# Altium project LightLink_V4.PrjPcb (part 1 of 2)
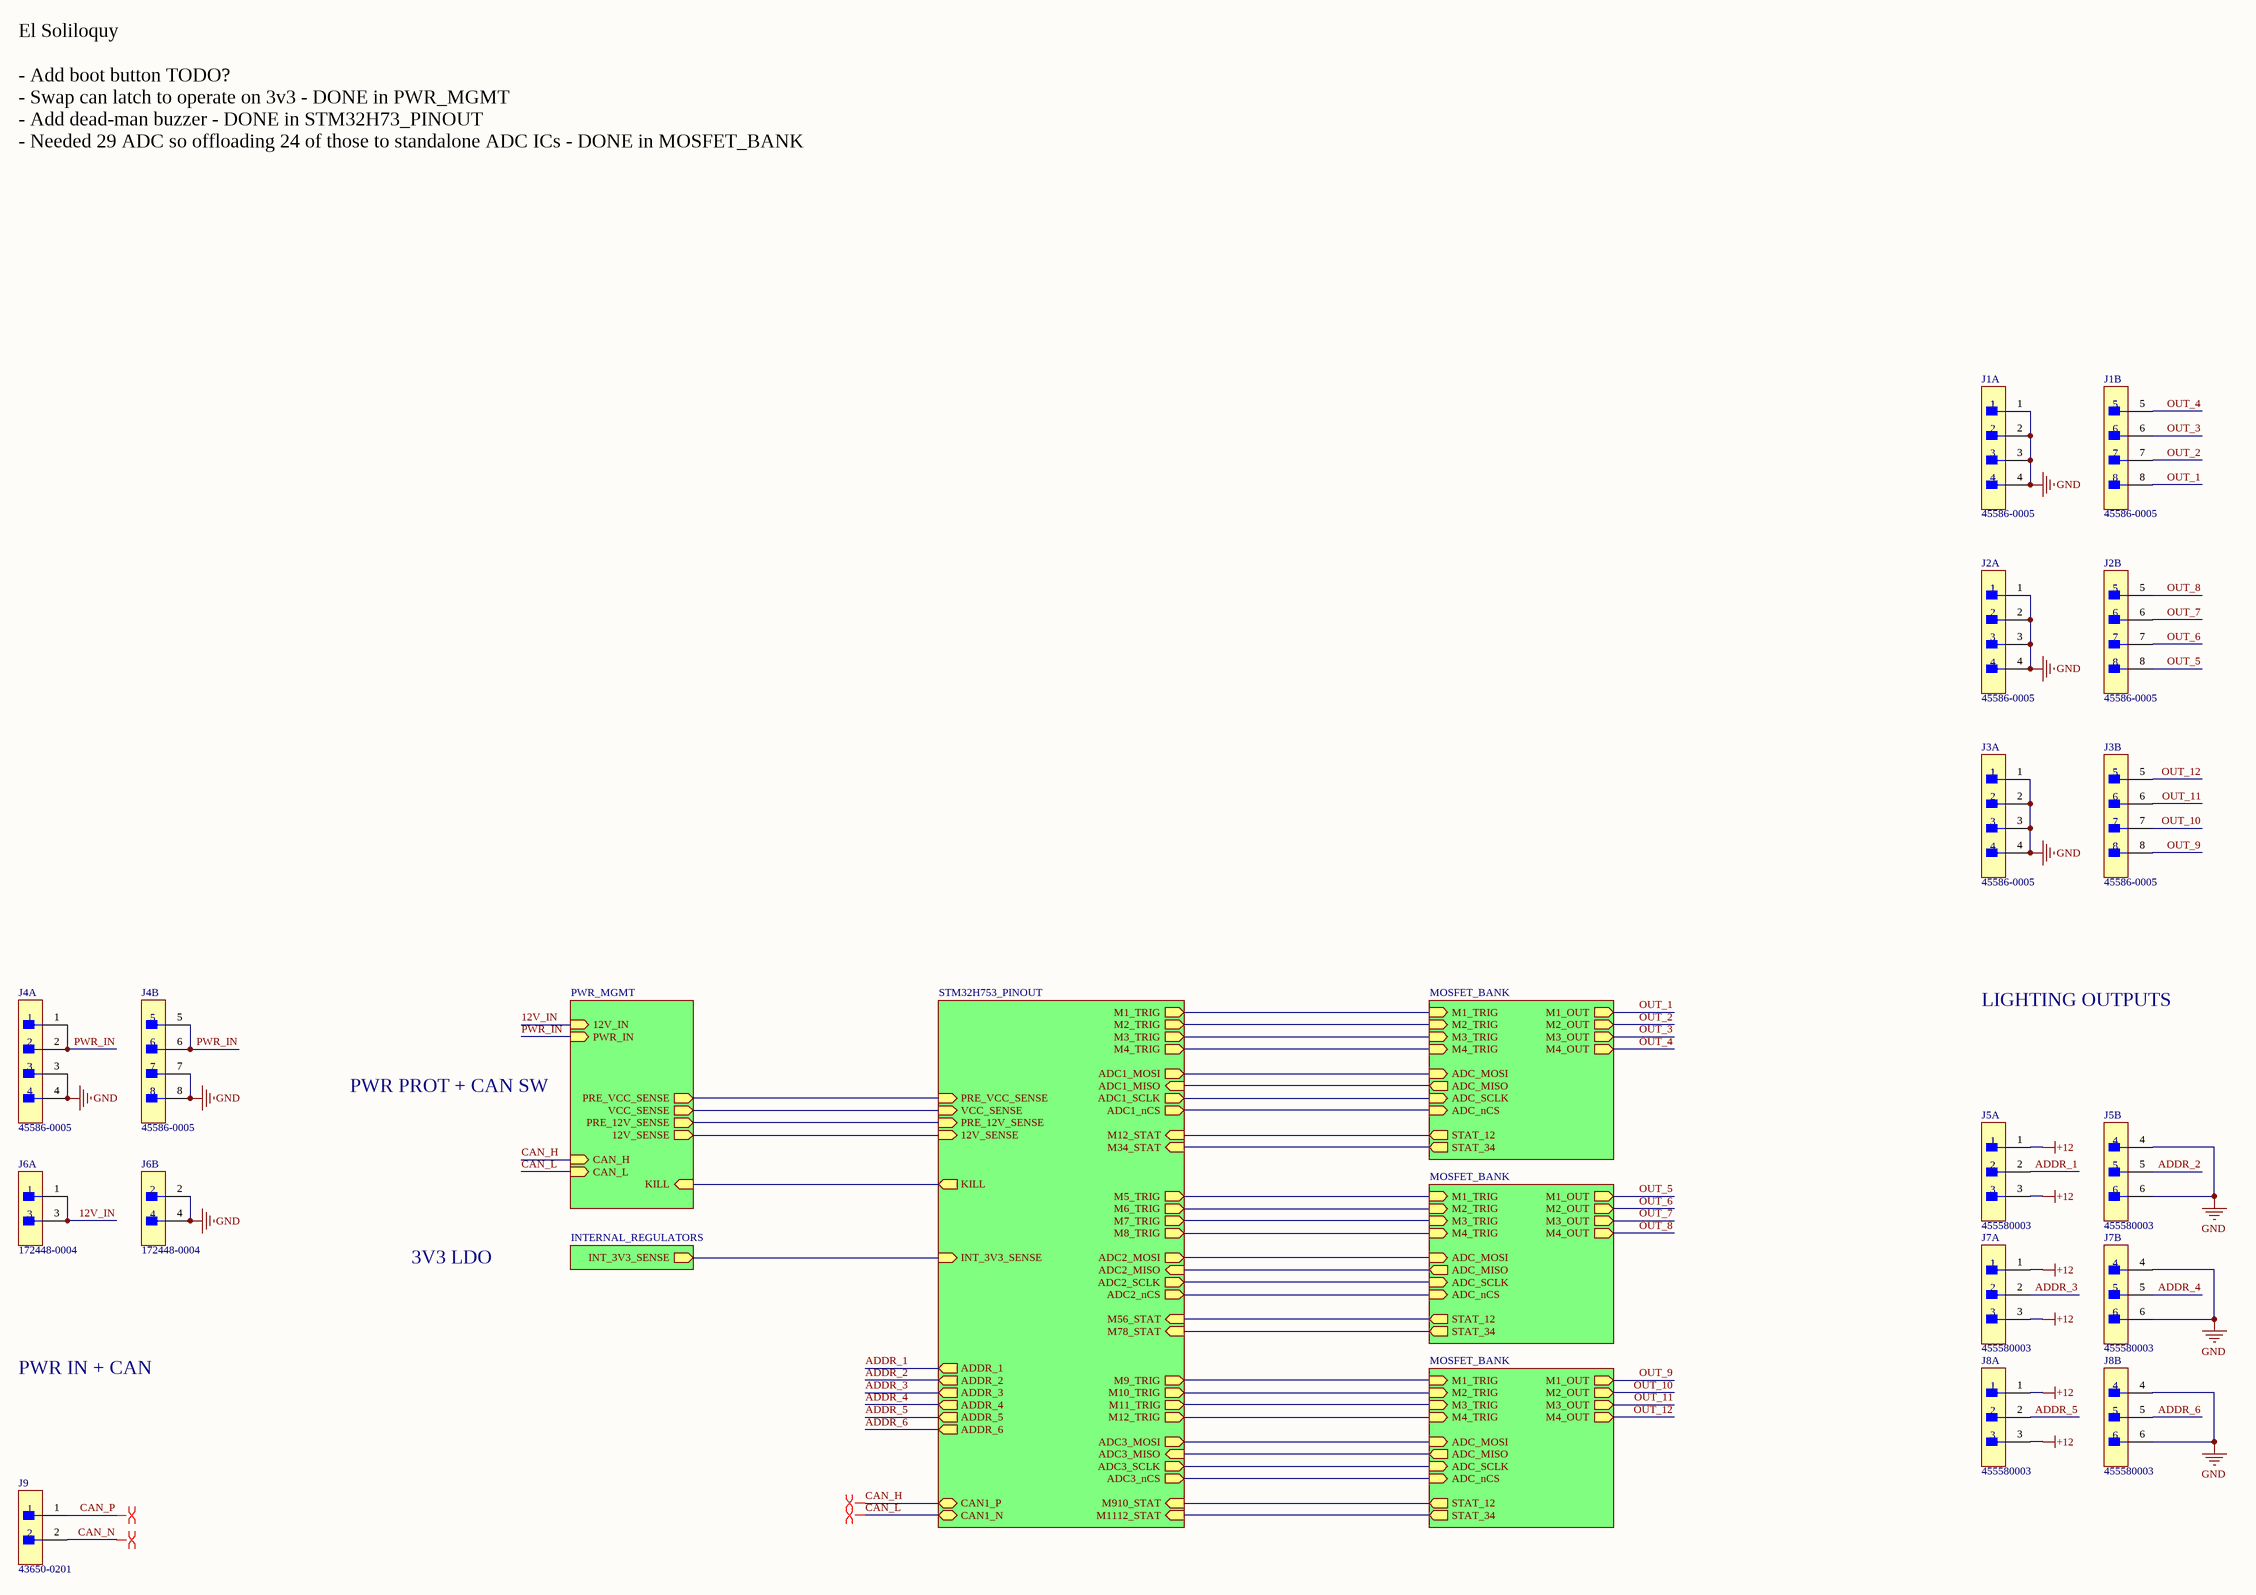
[diagram p0: LightLink_V4.SchDoc]
5 sheets, 309 parts. Net scope: hierarchical (ports join the sheet entries above them; power ports are global).
Board file: LightLink_V4.PcbDoc
Sheets:
  LightLink_V4.SchDoc
    PWR_MGMT = PWR_MGMT.SchDoc
    INTERNAL_REGULATORS = INTERNAL_REGULATORS.SchDoc
    STM32H753_PINOUT = STM32H753_PINOUT.SchDoc
    MOSFET_BANK = MOSFET_BANK.SchDoc
    MOSFET_BANK = MOSFET_BANK.SchDoc
    MOSFET_BANK = MOSFET_BANK.SchDoc

## Sheet LightLink_V4.SchDoc
size C; SheetNumber: 1; SheetTotal: 5

### Parts
J1  45586-0005  [FP-45586-0005-MFG]  (parts A,B of 2)
J2  45586-0005  [FP-45586-0005-MFG]  (parts A,B of 2)
J3  45586-0005  [FP-45586-0005-MFG]  (parts A,B of 2)
J4  45586-0005  [FP-45586-0005-MFG]  (parts A,B of 2)
J5  455580003  [FP-455580003-MFG]  (parts A,B of 2)
J6  172448-0004  [FP-39-30-1041-MFG]  (parts A,B of 2)
J7  455580003  [FP-455580003-MFG]  (parts A,B of 2)
J8  455580003  [FP-455580003-MFG]  (parts A,B of 2)
J9  43650-0201  [FP-43650-0201-MFG]

### Sub-sheets
INTERNAL_REGULATORS = INTERNAL_REGULATORS: INT_3V3_SENSE (out)
MOSFET_BANK = MOSFET_BANK: M1_OUT (out), M2_OUT (out), M3_OUT (out), M4_OUT (out), M1_TRIG (in), M2_TRIG (in), M3_TRIG (in), M4_TRIG (in), STAT_12 (out), STAT_34 (out), ADC_MOSI (in), ADC_MISO (out), ADC_SCLK (in), ADC_nCS (in)
MOSFET_BANK = MOSFET_BANK: M1_OUT (out), M2_OUT (out), M3_OUT (out), M4_OUT (out), M1_TRIG (in), M2_TRIG (in), M3_TRIG (in), M4_TRIG (in), STAT_12 (out), STAT_34 (out), ADC_MOSI (in), ADC_MISO (out), ADC_SCLK (in), ADC_nCS (in)
MOSFET_BANK = MOSFET_BANK: M1_OUT (out), M2_OUT (out), M3_OUT (out), M4_OUT (out), M1_TRIG (in), M2_TRIG (in), M3_TRIG (in), M4_TRIG (in), STAT_12 (out), STAT_34 (out), ADC_MOSI (in), ADC_MISO (out), ADC_SCLK (in), ADC_nCS (in)
PWR_MGMT = PWR_MGMT: PWR_IN (in), 12V_IN (in), PRE_VCC_SENSE (out), VCC_SENSE (out), PRE_12V_SENSE (out), 12V_SENSE (out), CAN_H (in), CAN_L (in), KILL (in)
STM32H753_PINOUT = STM32H753_PINOUT: CAN1_P (bidir), CAN1_N (bidir), KILL (out), M1_TRIG (out), M2_TRIG (out), M3_TRIG (out), M4_TRIG (out), M12_STAT (in), M34_STAT (in), PRE_VCC_SENSE (in), VCC_SENSE (in), PRE_12V_SENSE (in), 12V_SENSE (in), ADC1_MOSI (out), ADC1_MISO (in), ADC1_SCLK (out), ADC1_nCS (out), M5_TRIG (out), M6_TRIG (out), M7_TRIG (out), M8_TRIG (out), M9_TRIG (out), M10_TRIG (out), M11_TRIG (out), M12_TRIG (out), M56_STAT (in), M78_STAT (in), M910_STAT (in), M1112_STAT (in), ADC3_MOSI (out), ADC3_MISO (in), ADC3_SCLK (out), ADC3_nCS (out), ADC2_MOSI (out), ADC2_MISO (in), ADC2_SCLK (out), ADC2_nCS (out), INT_3V3_SENSE (in), ADDR_1 (out), ADDR_2 (out), ADDR_3 (out), ADDR_4 (out), ADDR_5 (out), ADDR_6 (out)

### Nets
+12: J5.1 J5.3 J7.1 J7.3 J8.1 J8.3
GND: J1.1 J1.2 J1.3 J1.4 J2.1 J2.2 J2.3 J2.4 J3.1 J3.2 J3.3 J3.4 J4.3 J4.4 J4.7 J4.8 J5.4 J5.6 J6.2 J6.4 J7.4 J7.6 J8.4 J8.6
12V_IN: J6.1 J6.3 ; sheet PWR_MGMT/12V_IN
12V_SENSE: sheet PWR_MGMT/12V_SENSE, sheet STM32H753_PINOUT/12V_SENSE
ADC1_MISO: sheet STM32H753_PINOUT/ADC1_MISO, sheet MOSFET_BANK/ADC_MISO
ADC1_MOSI: sheet STM32H753_PINOUT/ADC1_MOSI, sheet MOSFET_BANK/ADC_MOSI
ADC1_nCS: sheet STM32H753_PINOUT/ADC1_nCS, sheet MOSFET_BANK/ADC_nCS
ADC1_SCLK: sheet STM32H753_PINOUT/ADC1_SCLK, sheet MOSFET_BANK/ADC_SCLK
ADC2_MISO: sheet STM32H753_PINOUT/ADC2_MISO, sheet MOSFET_BANK/ADC_MISO
ADC2_MOSI: sheet STM32H753_PINOUT/ADC2_MOSI, sheet MOSFET_BANK/ADC_MOSI
ADC2_nCS: sheet STM32H753_PINOUT/ADC2_nCS, sheet MOSFET_BANK/ADC_nCS
ADC2_SCLK: sheet STM32H753_PINOUT/ADC2_SCLK, sheet MOSFET_BANK/ADC_SCLK
ADC3_MISO: sheet STM32H753_PINOUT/ADC3_MISO, sheet MOSFET_BANK/ADC_MISO
ADC3_MOSI: sheet STM32H753_PINOUT/ADC3_MOSI, sheet MOSFET_BANK/ADC_MOSI
ADC3_nCS: sheet STM32H753_PINOUT/ADC3_nCS, sheet MOSFET_BANK/ADC_nCS
ADC3_SCLK: sheet STM32H753_PINOUT/ADC3_SCLK, sheet MOSFET_BANK/ADC_SCLK
ADDR_1: J5.2 ; sheet STM32H753_PINOUT/ADDR_1
ADDR_2: J5.5 ; sheet STM32H753_PINOUT/ADDR_2
ADDR_3: J7.2 ; sheet STM32H753_PINOUT/ADDR_3
ADDR_4: J7.5 ; sheet STM32H753_PINOUT/ADDR_4
ADDR_5: J8.2 ; sheet STM32H753_PINOUT/ADDR_5
ADDR_6: J8.5 ; sheet STM32H753_PINOUT/ADDR_6
CAN_H: sheet PWR_MGMT/CAN_H, sheet STM32H753_PINOUT/CAN1_P  [project net CAN1_P]
CAN_L: sheet PWR_MGMT/CAN_L, sheet STM32H753_PINOUT/CAN1_N  [project net CAN1_N]
CAN_N: J9.2
CAN_P: J9.1
INT_3V3_SENSE: sheet INTERNAL_REGULATORS/INT_3V3_SENSE, sheet STM32H753_PINOUT/INT_3V3_SENSE
KILL: sheet PWR_MGMT/KILL, sheet STM32H753_PINOUT/KILL
M1_TRIG: sheet STM32H753_PINOUT/M1_TRIG, sheet MOSFET_BANK/M1_TRIG
M2_TRIG: sheet STM32H753_PINOUT/M2_TRIG, sheet MOSFET_BANK/M2_TRIG
M3_TRIG: sheet STM32H753_PINOUT/M3_TRIG, sheet MOSFET_BANK/M3_TRIG
M4_TRIG: sheet STM32H753_PINOUT/M4_TRIG, sheet MOSFET_BANK/M4_TRIG
M5_TRIG: sheet STM32H753_PINOUT/M5_TRIG, sheet MOSFET_BANK/M1_TRIG
M6_TRIG: sheet STM32H753_PINOUT/M6_TRIG, sheet MOSFET_BANK/M2_TRIG
M7_TRIG: sheet STM32H753_PINOUT/M7_TRIG, sheet MOSFET_BANK/M3_TRIG
M8_TRIG: sheet STM32H753_PINOUT/M8_TRIG, sheet MOSFET_BANK/M4_TRIG
M9_TRIG: sheet STM32H753_PINOUT/M9_TRIG, sheet MOSFET_BANK/M1_TRIG
M10_TRIG: sheet STM32H753_PINOUT/M10_TRIG, sheet MOSFET_BANK/M2_TRIG
M11_TRIG: sheet STM32H753_PINOUT/M11_TRIG, sheet MOSFET_BANK/M3_TRIG
M12_STAT: sheet STM32H753_PINOUT/M12_STAT, sheet MOSFET_BANK/STAT_12
M12_TRIG: sheet STM32H753_PINOUT/M12_TRIG, sheet MOSFET_BANK/M4_TRIG
M34_STAT: sheet STM32H753_PINOUT/M34_STAT, sheet MOSFET_BANK/STAT_34
M56_STAT: sheet STM32H753_PINOUT/M56_STAT, sheet MOSFET_BANK/STAT_12
M78_STAT: sheet STM32H753_PINOUT/M78_STAT, sheet MOSFET_BANK/STAT_34
M910_STAT: sheet STM32H753_PINOUT/M910_STAT, sheet MOSFET_BANK/STAT_12
M1112_STAT: sheet STM32H753_PINOUT/M1112_STAT, sheet MOSFET_BANK/STAT_34
OUT_1: J1.8 ; sheet MOSFET_BANK/M1_OUT  [project net M1_OUT]
OUT_2: J1.7 ; sheet MOSFET_BANK/M2_OUT  [project net M2_OUT]
OUT_3: J1.6 ; sheet MOSFET_BANK/M3_OUT  [project net M3_OUT]
OUT_4: J1.5 ; sheet MOSFET_BANK/M4_OUT  [project net M4_OUT]
OUT_5: J2.8 ; sheet MOSFET_BANK/M1_OUT  [project net M1_OUT]
OUT_6: J2.7 ; sheet MOSFET_BANK/M2_OUT  [project net M2_OUT]
OUT_7: J2.6 ; sheet MOSFET_BANK/M3_OUT  [project net M3_OUT]
OUT_8: J2.5 ; sheet MOSFET_BANK/M4_OUT  [project net M4_OUT]
OUT_9: J3.8 ; sheet MOSFET_BANK/M1_OUT  [project net M1_OUT]
OUT_10: J3.7 ; sheet MOSFET_BANK/M2_OUT  [project net M2_OUT]
OUT_11: J3.6 ; sheet MOSFET_BANK/M3_OUT  [project net M3_OUT]
OUT_12: J3.5 ; sheet MOSFET_BANK/M4_OUT  [project net M4_OUT]
PRE_12V_SENSE: sheet PWR_MGMT/PRE_12V_SENSE, sheet STM32H753_PINOUT/PRE_12V_SENSE
PRE_VCC_SENSE: sheet PWR_MGMT/PRE_VCC_SENSE, sheet STM32H753_PINOUT/PRE_VCC_SENSE
PWR_IN: J4.1 J4.2 J4.5 J4.6 ; sheet PWR_MGMT/PWR_IN
VCC_SENSE: sheet PWR_MGMT/VCC_SENSE, sheet STM32H753_PINOUT/VCC_SENSE

### Layout directives
differential pair: CAN1_N, CAN1_P, CAN_N, CAN_P

### Notes on the sheet
- El Soliloquy
  - Add boot button TODO?
  - Swap can latch to operate on 3v3 - DONE in PWR_MGMT
  - Add dead-man buzzer - DONE in STM32H73_PINOUT
  - Needed 29 ADC so offloading 24 of those to standalone ADC ICs - DONE in MOSFET_BANK
- LIGHTING OUTPUTS
- PWR PROT + CAN SW
- 3V3 LDO
- PWR IN + CAN

### Library data of the parts
J1-J4 = CMP-04776-000690-1: CONN HEADER R/A 8POS 4.2MM
J5 J7 J8 = CMP-04776-000024-1: CONN HEADER R/A 6POS 4.2MM; Manufacturer: Molex; Standoff Height: 0.4mm; Conn Orientation: Right Angle; Number Of Contacts: 6; Conn Gender: Male; Voltage Rating: 600V; Current Rating: 8A; Footprint Url: https://www.molex.com/pdm_docs/sd/455580003_sd.pdf; Number Of Rows: 2; Lead Free: Yes; Digikey Description: CONN HEADER R/A 6POS 4.2MM; ComponentLink2URL: https://www.molex.com/webdocs/datasheets/pdf/en-us/0455580003_PCB_HEADERS.pdf; Octopart: https://octopart.com/45558-0003-molex-7672845; Package: 0; Device Class L3: unset; ComponentLink2Description: Datasheet; Device Class L2: Headers and Wire Housings; Category: Conn; Contact Material: Tin,Nickel; Mouser Description: Conn Power HDR 6 POS 4.2mm Solder ST Thru-Hole 6 Terminal 1 Port Mini-Fit Jr™ Tray; Manufacturer Part Number: 455580003; Pitch: 4.2mm; Device Class L1: Connectors; Temperature Range Low: -40°C; Temperature: -40°C to +105°C; RoHS: TRUE; Temperature Range High: +105°C; Height: 10.38mm; Automotive: No
J6 = CMP-04776-000047-1: Different component but holes should line up. Original P/N is 39-30-1041; Manufacturer: Molex; Old_Part_Number: 5569-04A2G; Keying_to_Mating_Part: None; Circuits_maximum: 4; First_Mate__Last_Break: No; Lead_freeProcess_Capability: WAVE; Duration_at_Max_Process_Temperature_seconds: 005; Sales_Drawing: SDA-5569-NA2*-*; Current Rating: 13A; Material___Plating_Mating: Gold; Conn Gender: Male; Test_Summary: TS-5556-002; Color___Resin: Natural; Termination_Interface_Style: Through Hole; Pitch___Termination_Interface: 4.20mm; UL: E29179; PCB_Retention: Yes; Product_Name: Mini-Fit Jr.TM; Material___Resin: Nylon; Overview: Mini-Fit Jr. Power Connectors; CSA: LR19980; Plating_min___Termination: 2.540μm; Packaging_Type: Bag; Number_of_Rows: 2; Durability_mating_cycles_max: 30; Max_Cycles_at_Max_Process_Temperature: 001; Product_Specification: PS-45750-001, PS-5556-001; Net_Weight: 1.529/g; Voltage___Maximum: 600V; Material___Metal: Brass; Pitch: 4.2mm; Packaging_Specification: PK-5569-002; Shrouded: Fully; Plating_min___Mating: 0.762μm; Temperature_Range___Operating: -40°C to +105°C; Current___Maximum_per_Contact: 13.0A; Comments: Current = 13A max. per circuit when header is mated to a receptacle loaded with  45750  Mini-Fit® Plus HCS Crimp Terminal Crimped to 16 AWG wire.,  See Molex Product specification PS-5556-001 for additional current de-rating information.; Process_Temperature_max_C: 240; PCB_Thickness___Recommended: 1.78mm; Standoff Height: 0.016inch; Surface_Mount_Compatible_SMC: No; UPC: 800753579651; Conn Orientation: Right Angle; Material___Plating_Termination: Matte Tin; ComponentLink2Description: Datasheet; Footprint Url: https://www.molex.com/pdm_docs/sd/039301041_sd.pdf; Contact Material: Gold,Nickel; Octopart: https://octopart.com/39-30-1041-molex-276737; Digikey Description: CONN HEADER R/A 4POS 4.2MM; imported: yes; Series: 5569; Mouser Description: Headers & Wire Housings 4 CKT R/A HEADER; Temperature Range High: +105°C; Category: Conn; Polarized_to_Mating_Part: Yes; Pitch___Mating_Interface: 4.20mm; Automotive: No; Guide_to_Mating_Part: No; Lock_to_Mating_Part: Yes; Number Of Contacts: 4; Temperature Range Low: -40°C; RoHS: TRUE; Status: Active; imported_from: 3D Model; ComponentLink2URL: http://www.molex.com/pdm_docs/sd/039301041_sd.pdf; part_page: http://www.molex.com/molex/products/datasheet.jsp?part=active/0039301041_PCB_HEADERS.xml; Temperature: -40°C to +105°C; Device Class L3: unset; Device Class L1: Connectors; Package: 39-30-1041; Circuits_Loaded: 4; Lead Free: Yes; Ipc Land Pattern Name: CAPAD1016W80L630D240; Application: Power, Wire-to-Board; Voltage Rating: 600V; Manufacturer Part Number: 39-30-1041; Breakaway: No; Orientation: Right Angle; Flammability: 94V-2; 3D_model: http://www.molex.com/pdm_docs/stp/39-30-1041_stp.zip; Number Of Rows: 2; Polarized_to_PCB: Yes; Device Class L2: Headers and Wire Housings; Glow_Wire_Compliant: No; Stackable: No; PCB_Locator: Yes
J9 = CMP-04776-000557-1: CONN HEADER R/A 2POS 3MM; Voltage Rating: 600V; Number of Circuits: 2; Insulation Resistance: 1GR; Current Rating: 5A; Voltage Rating (DC): 250V; Contact Resistance: 10mR; Gender: Male; Number of Ports: 1; Glow Wire Compliant: Compliant; Pitch: 3mm; Contact Plating: Gold; Series: 43650; Color: Black; Max Operating Temperature: 105°C; Radiation Hardening: No; Orientation: Right Angle; Number of Terminals/Pins: 2; Length: 9.65mm; Case/Package: 0201; Halogen Free: Low Halogen; Housing Color: Black; Min Operating Temperature: -40°C; Package Quantity: 3927; Contact Material: Brass; Number of Rows: 1; Number of Positions: 2; Termination: Solder; Depth: 9.9mm; Mount: Through Hole; Packaging: Tray; Number of Contacts: 2; Housing Material: Thermoplastic; Flammability Rating: UL94 V-0

## Sheet PWR_MGMT.SchDoc
size C; SheetNumber: 2; SheetTotal: 5
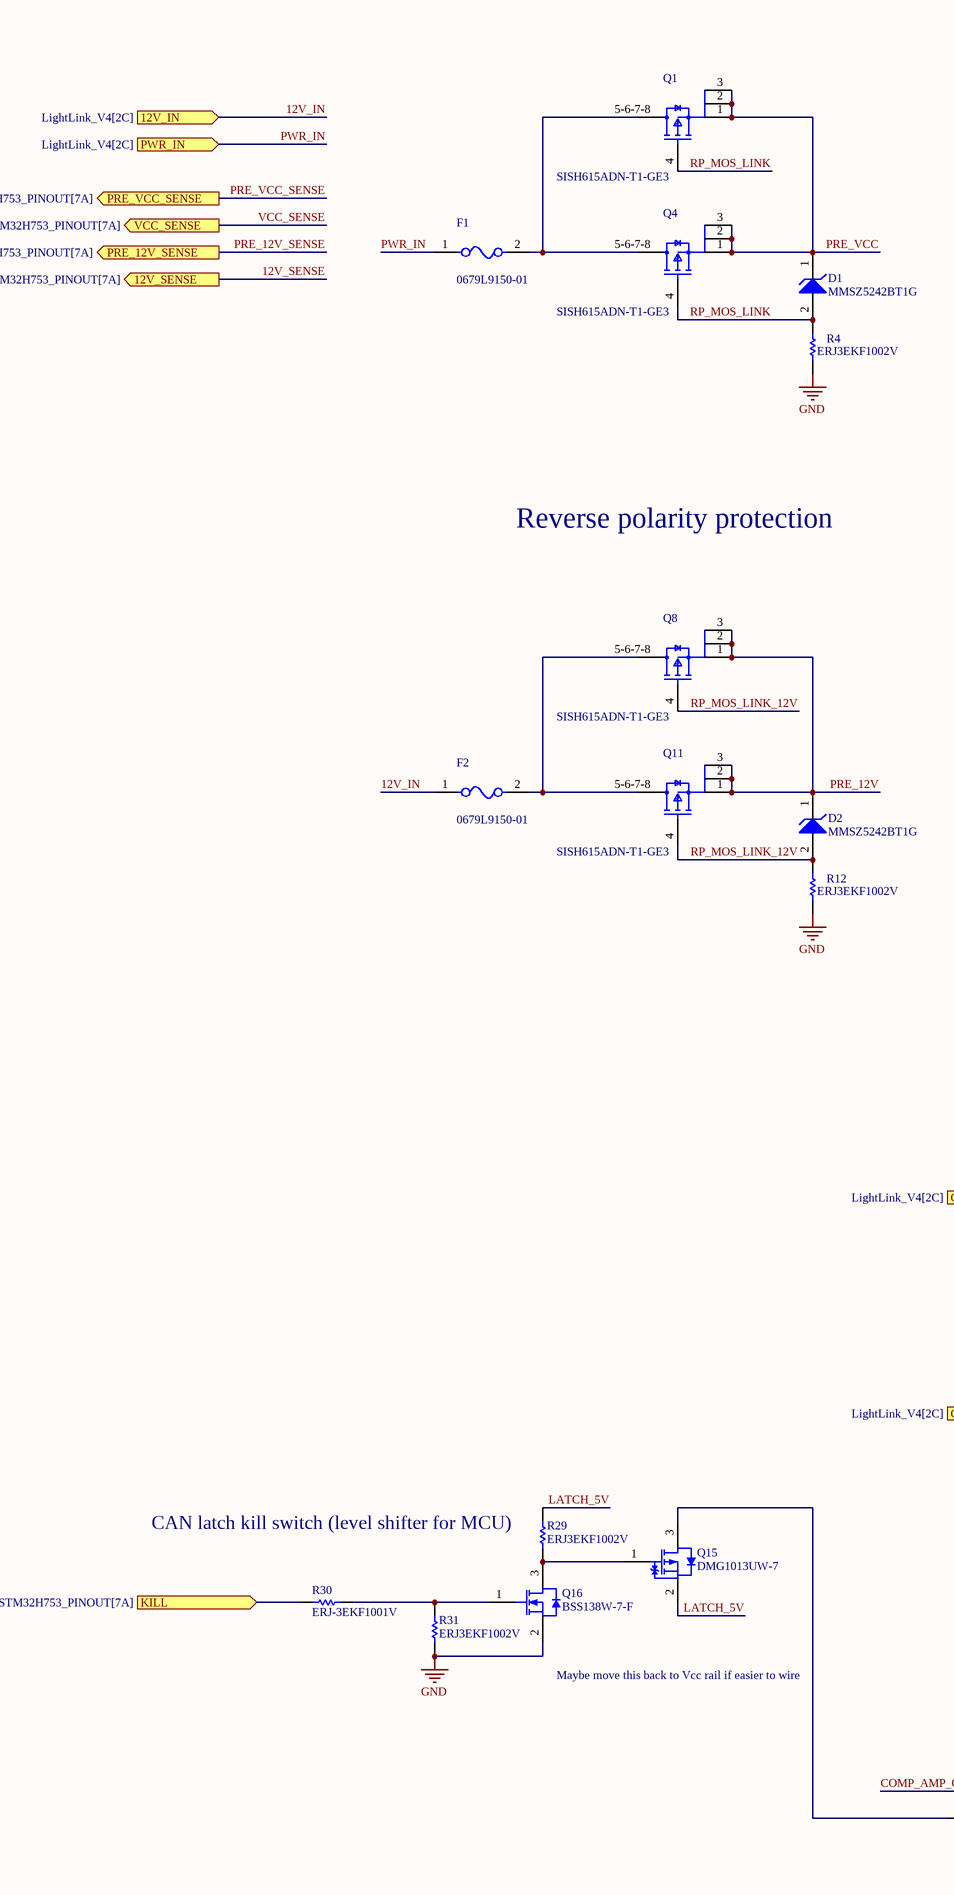
[diagram p1: PWR_MGMT.SchDoc, left]
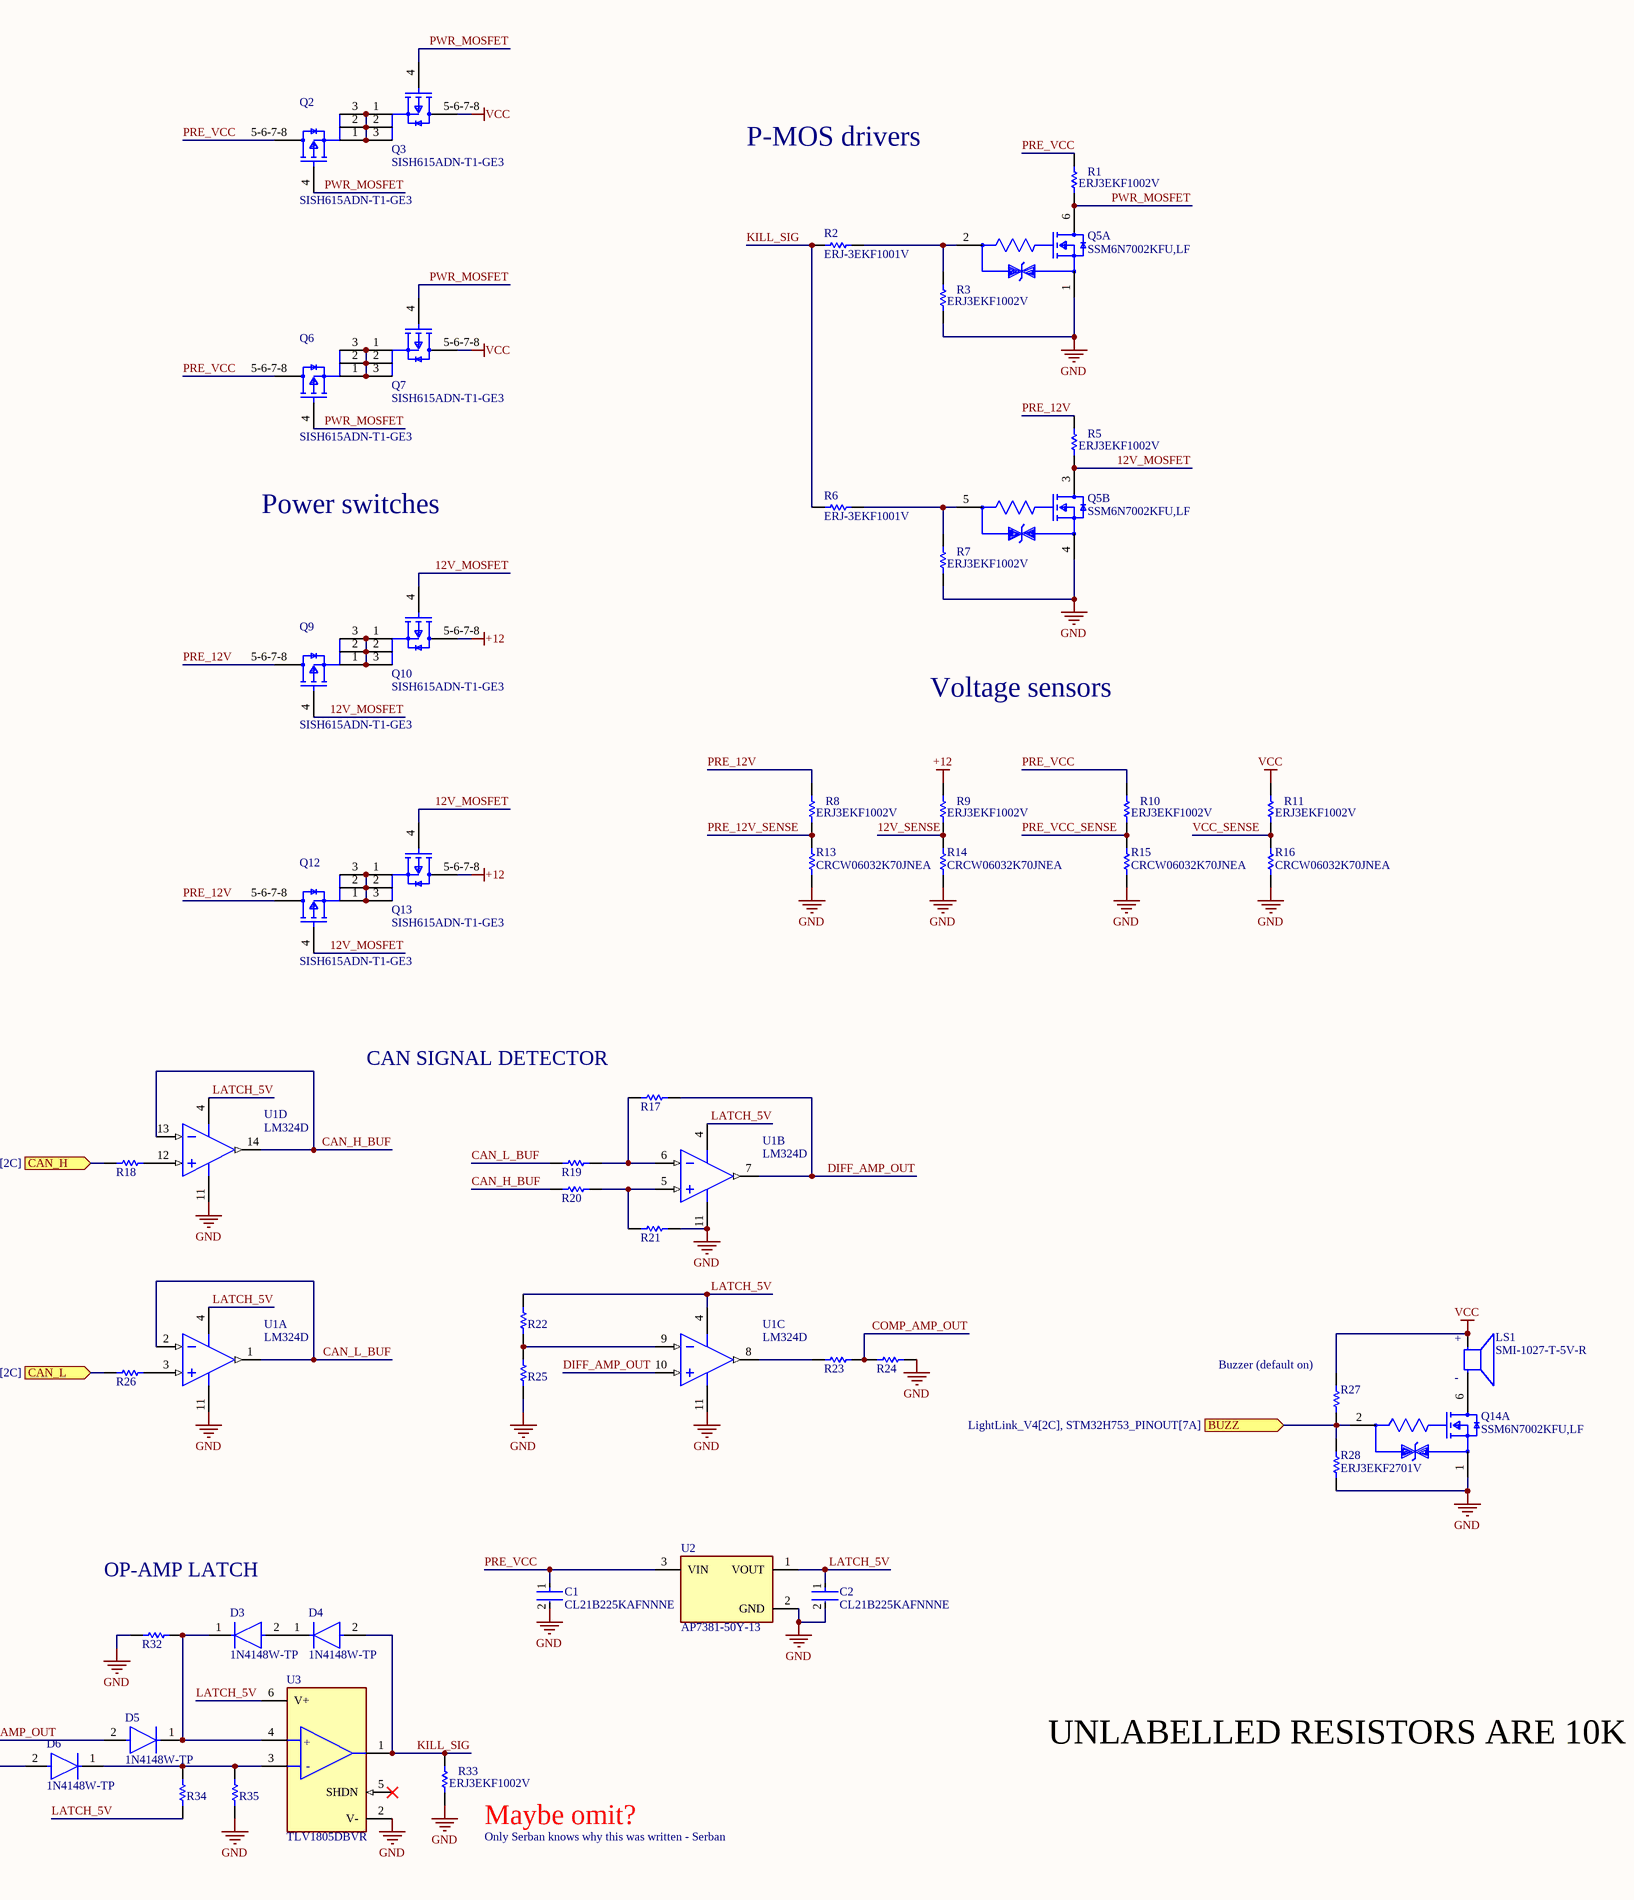
[diagram p2: PWR_MGMT.SchDoc, right]

### Parts
C1  CL21B225KAFNNNE  [FP-0805-L_2_01_0_2-W_1_25-IPC_B]
C2  CL21B225KAFNNNE  [FP-0805-L_2_01_0_2-W_1_25-IPC_B]
D1  MMSZ5242BT1G  [ONSC-SOD-123-2-425-04_V]
D2  MMSZ5242BT1G  [ONSC-SOD-123-2-425-04_V]
D3  1N4148W-TP  [FP-SOD-123-IPC_A]
D4  1N4148W-TP  [FP-SOD-123-IPC_A]
D5  1N4148W-TP  [FP-SOD-123-IPC_A]
D6  1N4148W-TP  [FP-SOD-123-IPC_A]
F1  0679L9150-01  [FP-0679L-MFG]
F2  0679L9150-01  [FP-0679L-MFG]
LS1  SMI-1027-T-5V-R  [SMI-1027-T-5V-R-Footprint-1]
Q1  SISH615ADN-T1-GE3  [SISH615ADN-T1-GE3-Footprint-1]
Q2  SISH615ADN-T1-GE3  [SISH615ADN-T1-GE3-Footprint-1]
Q3  SISH615ADN-T1-GE3  [SISH615ADN-T1-GE3-Footprint-1]
Q4  SISH615ADN-T1-GE3  [SISH615ADN-T1-GE3-Footprint-1]
Q5  SSM6N7002KFU,LF  [FP-SSOP6-P-0_65A-MFG]  (parts A,B of 2)
Q6  SISH615ADN-T1-GE3  [SISH615ADN-T1-GE3-Footprint-1]
Q7  SISH615ADN-T1-GE3  [SISH615ADN-T1-GE3-Footprint-1]
Q8  SISH615ADN-T1-GE3  [SISH615ADN-T1-GE3-Footprint-1]
Q9  SISH615ADN-T1-GE3  [SISH615ADN-T1-GE3-Footprint-1]
Q10  SISH615ADN-T1-GE3  [SISH615ADN-T1-GE3-Footprint-1]
Q11  SISH615ADN-T1-GE3  [SISH615ADN-T1-GE3-Footprint-1]
Q12  SISH615ADN-T1-GE3  [SISH615ADN-T1-GE3-Footprint-1]
Q13  SISH615ADN-T1-GE3  [SISH615ADN-T1-GE3-Footprint-1]
Q14  SSM6N7002KFU,LF  [FP-SSOP6-P-0_65A-MFG]  (part A of 2)
Q15  DMG1013UW-7  [DIOD-SOT323-3_V]
Q16  BSS138W-7-F  [DIOD-SOT323-3_V]
R1  ERJ3EKF1002V  [RESC1609X55X30LL15T15]
R2  ERJ-3EKF1001V  [RESC1608X55X30LL15T15]
R3  ERJ3EKF1002V  [RESC1609X55X30LL15T15]
R4  ERJ3EKF1002V  [RESC1609X55X30LL15T15]
R5  ERJ3EKF1002V  [RESC1609X55X30LL15T15]
R6  ERJ-3EKF1001V  [RESC1608X55X30LL15T15]
R7  ERJ3EKF1002V  [RESC1609X55X30LL15T15]
R8  ERJ3EKF1002V  [RESC1609X55X30LL15T15]
R9  ERJ3EKF1002V  [RESC1609X55X30LL15T15]
R10  ERJ3EKF1002V  [RESC1609X55X30LL15T15]
R11  ERJ3EKF1002V  [RESC1609X55X30LL15T15]
R12  ERJ3EKF1002V  [RESC1609X55X30LL15T15]
R13  CRCW06032K70JNEA  [RESC1609X50X30ML10T20]
R14  CRCW06032K70JNEA  [RESC1609X50X30ML10T20]
R15  CRCW06032K70JNEA  [RESC1609X50X30ML10T20]
R16  CRCW06032K70JNEA  [RESC1609X50X30ML10T20]
R17  ERJ3EKF1002V  [RESC1609X55X30LL15T15]  (value not drawn)
R18  ERJ3EKF1002V  [RESC1609X55X30LL15T15]  (value not drawn)
R19  ERJ3EKF1002V  [RESC1609X55X30LL15T15]  (value not drawn)
R20  ERJ3EKF1002V  [RESC1609X55X30LL15T15]  (value not drawn)
R21  ERJ3EKF1002V  [RESC1609X55X30LL15T15]  (value not drawn)
R22  ERJ3EKF1002V  [RESC1609X55X30LL15T15]  (value not drawn)
R23  ERJ3EKF1002V  [RESC1609X55X30LL15T15]  (value not drawn)
R24  ERJ3EKF1002V  [RESC1609X55X30LL15T15]  (value not drawn)
R25  ERJ-3EKF1001V  [RESC1608X55X30LL15T15]  (value not drawn)
R26  ERJ3EKF1002V  [RESC1609X55X30LL15T15]  (value not drawn)
R27  ERJ3EKF1002V  [RESC1609X55X30LL15T15]  (value not drawn)
R28  ERJ3EKF2701V  [RESC1608X55X30LL15T15]
R29  ERJ3EKF1002V  [RESC1609X55X30LL15T15]
R30  ERJ-3EKF1001V  [RESC1608X55X30LL15T15]
R31  ERJ3EKF1002V  [RESC1609X55X30LL15T15]
R32  ERJ3EKF1002V  [RESC1609X55X30LL15T15]  (value not drawn)
R33  ERJ3EKF1002V  [RESC1609X55X30LL15T15]
R34  ERJ3EKF1002V  [RESC1609X55X30LL15T15]  (value not drawn)
R35  ERJ3EKF1002V  [RESC1609X55X30LL15T15]  (value not drawn)
U1  LM324D  [D0014A_L]  (parts A,B,C,D of 4)
U2  AP7381-50Y-13  [FP-SOT89-MFG]
U3  TLV1805DBVR  [FP-DBV0006A-IPC_C]

### Ports
12V_IN (in, see LightLink_V4[2C]), 12V_SENSE (out, see LightLink_V4[2C], STM32H753_PINOUT[7A]), BUZZ (in, see LightLink_V4[2C], STM32H753_PINOUT[7A]), CAN_H (in, see LightLink_V4[2C]), CAN_L (in, see LightLink_V4[2C]), KILL (in, see LightLink_V4[2C], STM32H753_PINOUT[7A]), PRE_12V_SENSE (out, see LightLink_V4[2C], STM32H753_PINOUT[7A]), PRE_VCC_SENSE (out, see LightLink_V4[2C], STM32H753_PINOUT[7A]), PWR_IN (in, see LightLink_V4[2C]), VCC_SENSE (out, see LightLink_V4[2C], STM32H753_PINOUT[7A])

### Nets
+12: Q10.5-6-7-8(D) Q13.5-6-7-8(D) R9.1
GND: C1.2 C2.2 Q5.1(Source1) Q5.4(Source2) Q14.1(Source1) Q16.2(S) R3.2 R4.2 R7.2 R12.2 R13.1 R14.1 R15.1 R16.1 R21.2 R24.1 R25.1 R28.1 R31.1 R32.2 R33.2 R35.1 U1.11(GND) U2.2(GND) U3.2(V-)
VCC: LS1.LOAD+(POS) Q3.5-6-7-8(D) Q7.5-6-7-8(D) R11.1 R27.2
12V_IN: F2.1 ; port 12V_IN
12V_MOSFET: Q5.3(Drain2) Q9.4(G) Q10.4(G) Q12.4(G) Q13.4(G) R5.2
12V_SENSE: R9.2 R14.2 ; port 12V_SENSE
CAN1_N: R26.1 ; port CAN_L
CAN1_P: R18.1 ; port CAN_H
CAN_H_BUF: R20.1 U1.13(4IN-) U1.14(4OUT)
CAN_L_BUF: R19.1 U1.1(1OUT) U1.2(1IN-)
COMP_AMP_OUT: D5.2(A) R23.1 R24.2
DIFF_AMP_OUT: R17.2 U1.7(2OUT) U1.10(3IN+)
KILL: R30.2 ; port KILL
KILL_SIG: D4.2(A) R2.1 R6.1 R33.1 U3.1(OUT)
LATCH_5V: C2.1 Q15.2(S) R22.2 R29.2 R34.1 U1.4(VCC) U2.1(VOUT) U3.6(V+)
PRE_12V: D2.1(K) Q8.1(S) Q8.2(S) Q8.3(S) Q9.5-6-7-8(D) Q11.1(S) Q11.2(S) Q11.3(S) Q12.5-6-7-8(D) R5.1 R8.1
PRE_12V_SENSE: R8.2 R13.2 ; port PRE_12V_SENSE
PRE_VCC: C1.1 D1.1(K) Q1.1(S) Q1.2(S) Q1.3(S) Q2.5-6-7-8(D) Q4.1(S) Q4.2(S) Q4.3(S) Q6.5-6-7-8(D) R1.1 R10.1 U2.3(VIN)
PRE_VCC_SENSE: R10.2 R15.2 ; port PRE_VCC_SENSE
PWR_IN: F1.1 ; port PWR_IN
PWR_MOSFET: Q2.4(G) Q3.4(G) Q5.6(Drain1) Q6.4(G) Q7.4(G) R1.2
RP_MOS_LINK: D1.2(A) Q1.4(G) Q4.4(G) R4.1
RP_MOS_LINK_12V: D2.2(A) Q8.4(G) Q11.4(G) R12.1
VCC_SENSE: R11.2 R16.2 ; port VCC_SENSE
NetD3_1: D3.1(C) D5.1(C) R32.1 U3.4(+IN)
NetD3_2: D3.2(A) D4.1(C)
NetD6_1: D6.1(C) R34.2 R35.2 U3.3(-IN)
NetD6_2: D6.2(A) Q15.3(D)
NetF1_2: F1.2 Q1.5-6-7-8(D) Q4.5-6-7-8(D)
NetF2_2: F2.2 Q8.5-6-7-8(D) Q11.5-6-7-8(D)
NetLS1_LOAD-: LS1.LOAD-(NEG) Q14.6(Drain1)
NetQ2_1: Q2.1(S) Q2.2(S) Q2.3(S) Q3.1(S) Q3.2(S) Q3.3(S)
NetQ5_2: Q5.2(Gate1) R2.2 R3.1
NetQ5_5: Q5.5(Gate2) R6.2 R7.1
NetQ6_1: Q6.1(S) Q6.2(S) Q6.3(S) Q7.1(S) Q7.2(S) Q7.3(S)
NetQ9_1: Q9.1(S) Q9.2(S) Q9.3(S) Q10.1(S) Q10.2(S) Q10.3(S)
NetQ12_1: Q12.1(S) Q12.2(S) Q12.3(S) Q13.1(S) Q13.2(S) Q13.3(S)
NetQ14_2: Q14.2(Gate1) R27.1 R28.2 ; port BUZZ
NetQ15_1: Q15.1(G) Q16.3(D) R29.1
NetQ16_1: Q16.1(G) R30.1 R31.2
NetR17_1: R17.1 R19.2 U1.6(2IN-)
NetR18_2: R18.2 U1.12(4IN+)
NetR20_2: R20.2 R21.1 U1.5(2IN+)
NetR22_1: R22.1 R25.2 U1.9(3IN-)
NetR23_2: R23.2 U1.8(3OUT)
NetR26_2: R26.2 U1.3(1IN+)

Not connected (* = marked no-connect by the designer): U3 5(SHDN)*

### Notes on the sheet
- P-MOS drivers
- Reverse polarity protection
- Power switches
- Voltage sensors
- CAN SIGNAL DETECTOR
- (near R27) Buzzer (default on)
- (near R29) CAN latch kill switch (level shifter for MCU)
- OP-AMP LATCH
- Maybe move this back to Vcc rail if easier to wire
- UNLABELLED RESISTORS ARE 10K
- (near R33) Maybe omit?
- Only Serban knows why this was written - Serban
- (in symbol CMP-00027-00002-1) +; -
- (in symbol CMP-04896-000098-1) +; -

### Library data of the parts
C1 C2 = CMP-2007-04514-2: Voltage Rating (DC): 25V; Tolerance: 10%; Capacitance: 2.2uF; Dielectric: X7R; RoHS Compliant: Yes; Lead Free: Lead Free; Packaging: Tape and Reel; Case Code (Imperial): 0805; Case/Package: 0805; Contact Plating: Tin; Mount: Surface Mount; Construction: Flat; Voltage: 25V; REACH SVHC: No SVHC; Thickness: 0.06inch; Depth: 1.25mm; Max Operating Temperature: 125°C; Package Quantity: 3000; Width: 0.049inch; Height: 1.52mm; Case Code (Metric): 2012; Number of Pins: 2; Termination: SMD/SMT; Voltage Rating: 25V; Radiation Hardening: No; Series: FlEXITERM; Length: 2.01mm; Min Operating Temperature: -55°C
D1 D2 = CMP-1060-00565-1: Zener Voltage Regulator, 500 mW, 2-Pin SOD-123, Pb-Free, Tape and Reel; Manufacturer: On Semiconductor; P Max (W): 0.5; VZ Typ (V): 12; PartNumber: MMSZ5242BT1G; PackageReference: SOD-123-2-425-04; ComponentLink3URL: http://www.onsemi.com/pub_link/Collateral/425-04.PDF; Mounting Technology: Surface Mount; ComponentLink2Description: Datasheet; ComponentLink1URL: http://www.onsemi.com/; ComponentLink3Description: Package Specification; PackageDescription: 2-Pin SOD, Body 1.6 x 2.69 mm; PackageVersion: Rev. G, 10/2009; ComponentLink1Description: Manufacturer URL; RoHS: Pb-Free; ComponentLink2URL: http://www.onsemi.com/pub_link/Collateral/MMSZ5221BT1-D.PDF; Packing: Tape and Reel; DatasheetVersion: Rev. 12
D3-D6 = CMP-2000-04993-2: DIODE GEN PURP 100V 150MA SOD123; Max Reverse Leakage Current: 5uA; Max Surge Current: 2A; Reverse Recovery Time: 4ns; Polarity: Standard; Capacitance: 4pF; Max Forward Surge Current (Ifsm): 1A; Element Configuration: Single; Power Dissipation: 400mW; Forward Voltage: 1V; Radiation Hardening: No; Lead Free: Lead Free; Max Reverse Voltage (DC): 100V; Current Rating: 150mA; Forward Current: 150mA; Packaging: Tape and Reel; Number of Pins: 2; Package Quantity: 3000; Max Operating Temperature: 150°C; Min Operating Temperature: -65°C; Average Rectified Current: 150mA; Recovery Time: 4ns; Output Current: 150mA; Peak Non-Repetitive Surge Current: 2A; Width: 1.8mm; Voltage Rating (DC): 100V; Height: 1.2mm; Max Repetitive Reverse Voltage (Vrrm): 100V; Mount: Surface Mount; Length: 2.85mm
F1 F2 = CMP-16042-000002-1: FUSE BRD MNT 15A 125VAC/VDC; Manufacturer: Bel Fuse; Max Fuse Ac Voltage: 125V; Fuse Blow Speed: Fast; Fuse I2T: 103.5A2Sec; Fuse Interrupt Ac Current: 50A; Automotive Grade: Grade 1; Value: 0.0038Ω; Fuse Interrupt Dc Current: 300A; Fuse Voltage Drop: 0.13V; Device Class L2: Fuses; ComponentLink2URL: https://www.belfuse.com/resources/CircuitProtection/datasheets/0679L%20Sep2016.pdf; Package: 0679L; Height: 2.79mm; Digikey Description: FUSE BRD MNT 15A 125VAC/VDC; Temperature Range High: +125°C; Device Class L3: unset; Octopart: https://octopart.com/0679l9150-01-bel+fuse-70850665; Temperature Range Low: -55°C; Fuse Current: 15A; Max Fuse Dc Voltage: 125V; Ipc Land Pattern Name: CAPC610254X254; Manufacturer Part Number: 0679L9150-01; Category: Fuse; Lead Free: Yes; Automotive: Yes; Resistance: 0.0038Ω; RoHS: TRUE; Device Class L1: Circuit Protection; ComponentLink2Description: Datasheet; Temperature: -55°C to +125°C; Voltage Rating: 125V
LS1 = CMP-00027-00002-1: Audio Ind Magnt 5V 9.6X9.6MM SMD
Q1-Q4 Q6-Q13 = CMP-013-00036-2: Trans MOSFET P-CH 20V 22.1A 8-Pin PowerPAK 1212 EP T/R
Q5 Q14 = CMP-35916-000009-1: MOSFET 2N-CH 60V 0.3A; Input Capacitance: 40pF; Continuous Drain Current (ID): 300mA; Max Power Dissipation: 285mW; FET Type: 2 N-Channel; Rds On Max: 1.5R; Mount: Surface Mount; Drain to Source Voltage (Vdss): 60V; Packaging: Tape and Reel
Q15 = CMP-2000-06170-1: P-Channel Enhancement Mode MOSFET, 310 mW, 20 V, -55 to 150 degC, 3-Pin SOT-323, RoHS, Tape and Reel; Manufacturer: Diodes Inc; Qg Gate Charge: 0.622nC; Drain-Source On Resistance-Max: 750mO; Rated Power Dissipation: 310mW; Drain-to-Source Voltage [Vdss]: 20V; Package Reference: SOT323; Datasheet Version: Rev. 3-2, 09/2013; Package Description: 3-Pin Small Outline Transistor, Body 2 x 1.25 mm, Pitch 0.65 mm; Mounting Technology: SurfaceMount; Manufacturer URL: http://www.diodes.com/; Datasheet URL: http://www.diodes.com/_files/datasheets/ds31861.pdf; Channel Type: P-Channel
Q16 = CMP-2000-05968-1: N-Channel Enhancement Mode Mosfet, 50 V, 200 mA, -55 to 150 degC, 6-Pin SOT-323, RoHS, Tape and Reel; Typical Turn-Off Delay Time: 20ns; Number of Channels: 1Channel; Type: EnhancementModeFieldEffectTransistor; Brand: DiodesIncorporated; Vds - Drain-Source Breakdown Voltage: 75V; Vgs - Gate-Source Voltage: 20V; Rds On - Drain-Source Resistance: 1.4Ohms; Transistor Type: 1N-Channel; Configuration: Single; Unit Weight: 0.000212oz; Pd - Power Dissipation: 200mW; Id - Continuous Drain Current: 200mA; Forward Transconductance - Min: 0.1S; Manufacturer URL: http://www.diodes.com/; Series: BSS138; Package Description: 3-Pin Small Outline Transistor, Body 2 x 1.25 mm, Pitch 0.65 mm; Mounting Technology: SurfaceMount; Product Category: MOSFET; RoHS: True; Maximum Operating Temperature: +150C; Height: 1mm; Length: 2.2mm; Technology: Si; Width: 1.35mm; Datasheet URL: http://www.diodes.com/_files/datasheets/ds30206.pdf; Manufacturer: DiodesIncorporated; Package / Case: SOT-323-3; Typical Turn-On Delay Time: 20ns; Transistor Polarity: N-Channel; Factory Pack Quantity: 3000; Packaging: Reel; Product: MOSFETSmallSignal; Datasheet Version: Rev. 11-2, 09/2013; Package Reference: SOT323; Minimum Operating Temperature: -55C; Mounting Style: SMD/SMT; Channel Mode: Enhancement
R1 R3-R5 R7-R12 R17-R24 R26 R27 R29 R31-R35 = CMP-1012-00623-3: Chip Resistor, 10 KOhm, +/- 1%, 0.1 W, -55 to 155 degC, 0603 (1608 Metric), RoHS, Tape and Reel; Manufacturer: Panasonic; Voltage Rating: 75V; Case\/Package: 0603; Power Rating: 100mW; Resistance: 10KOhm; Temperature Coefficient: 100ppm\/degreesC; Number of Pins: 2; Package Reference: 603; Depth: 0.8mm; Mount: SurfaceMount; Package Description: 2-Pin Surface Mount Device, Body 1.6 x 0.85 mm; Datasheet Version: 02/2017; Length: 1.6mm; Lead Free: LeadFree; Height: 0.45mm; Number of Terminations: 2; Max Power Dissipation: 100mW; Min Operating Temperature: -55degC; Datasheet URL: https://industrial.panasonic.com/cdbs/www-data/pdf/RDA0000/AOA0000C304.pdf; Termination: SMD/SMT; Case Code (Metric): 1608; Case Code (Imperial): 0603; Tolerance: 1%; Max Operating Temperature: 155degC; RoHSCompliant: true; Voltage Rating (DC): 75V; Radiation Hardening: No; Packaging: TapeandReel; Composition: ThickFilm; Mounting Technology: SurfaceMount; Manufacturer URL: http://www.panasonic.com/; Width: 0.031inch; REACH SVHC: NoSVHC; Contact Plating: Tin; Military Standard: Not; Package Quantity: 1
R2 R6 R25 R30 = CMP-2000-00180-1: Manufacturer: Panasonic; Part Number: ERJ-3EKF1001V
R13-R16 = CMP-2000-03183-1: Manufacturer: Vishay Dale; Part Number: CRCW06032K70JNEA
R28 = CMP-2000-00389-1: Manufacturer: Panasonic; Part Number: ERJ3EKF2701V
U1 = CMP-2000-06547-1: Quadruple Operational Amplifier, 0.5 V/us, 1.2 MHz, 3 to 32 V, 0 to 70 degC, 14-Pin SOIC (D), Green (RoHS & no Sb/Br), Tube; Manufacturer: Texas Instruments; Unity Gain Bandwidth Product: 1.2MHz; Input Offset Voltage: 7mV; Dual Supply Voltage (Max): ±16V; Single Supply Voltage (Min): 3V; Single Supply Voltage (Max): 32V; Voltage Gain in dB: 100dB; Power Supply Requirement: Single/Dual; Input Bias Current: 250nA; Dual Supply Voltage (Min): ±1.5V; Single Supply Voltage (Typ): 5/9/12/15/18/24/28V; Dual Supply Voltage (Typ): ±3/±5/±9/±12/±15V; Number of  Elements: 4; Common Mode Rejection Ratio: 65dB; Datasheet Version: Rev. W, 03/2015; Technology: Bipolar; Shut Down Feature: No; Package Reference: D0014A; Type: GeneralPurposeAmplifier; Pin Count: 14; Package Type: SOIC; Rail/Rail I/O Type: No; Manufacturer URL: http://www.ti.com/; Package Description: 14-Pin Small Outline Integrated Circuit, Body 8.65 x 3.9 mm, Pitch 1.27 mm; Operating Temperature Classification: Commercial; Datasheet URL: http://www.ti.com/lit/ds/symlink/lm324.pdf; Slew Rate: 0.5V/us; Package URL: http://www.ti.com/lit/ml/mpds177g/mpds177g.pdf; Mounting: SurfaceMount; Packaging: Rail/Tube; Mounting Technology: SurfaceMount; Operating Temp Range: 0Cto70C
U2 = CMP-12756-000009-1: IC REG LINEAR 5V 150MA SOT89; Manufacturer: Diodes Inc.; Output Type: Fixed; Min Supply Voltage: 3.3V; Max Junction Temp: +125°C; Max Supply Voltage: 40V; Nominal Supply Current: 2.5-25uA; Number Of Outputs: 1; Dropout Voltage: 1000mV; Manufacturer Part Number: AP7381-50Y-13; RoHS: TRUE; Digikey Description: IC REG LINEAR 5V 150MA SOT89; Output Voltage: 5V; Footprint Url: https://www.diodes.com/assets/Package-Files/SOT89.pdf; Category: IC; Temperature: -40°C to +125°C; ComponentLink2Description: Datasheet; Package: SOT89; Temperature Range Low: -40°C; Temperature Range High: +125°C; ComponentLink2URL: https://www.diodes.com/assets/Datasheets/AP7381.pdf; Device Class L1: Integrated Circuits (ICs); Automotive: No; Output Current: 150mA; Ambient Temperature Range High: +85°C; Octopart: https://octopart.com/ap7381-50y-13-diodes+inc.-87775116; Lead Free: Yes; Device Class L2: Power Management ICs; Height: 1.6mm; Device Class L3: Voltage Regulators - Linear; Ambient Temperature Range Low: -40°C
U3 = CMP-04896-000098-1: 40V, RAIL-TO-RAIL INPUT, PUSH-PU

## Sheet INTERNAL_REGULATORS.SchDoc
size E; SheetNumber: 5; SheetTotal: 5
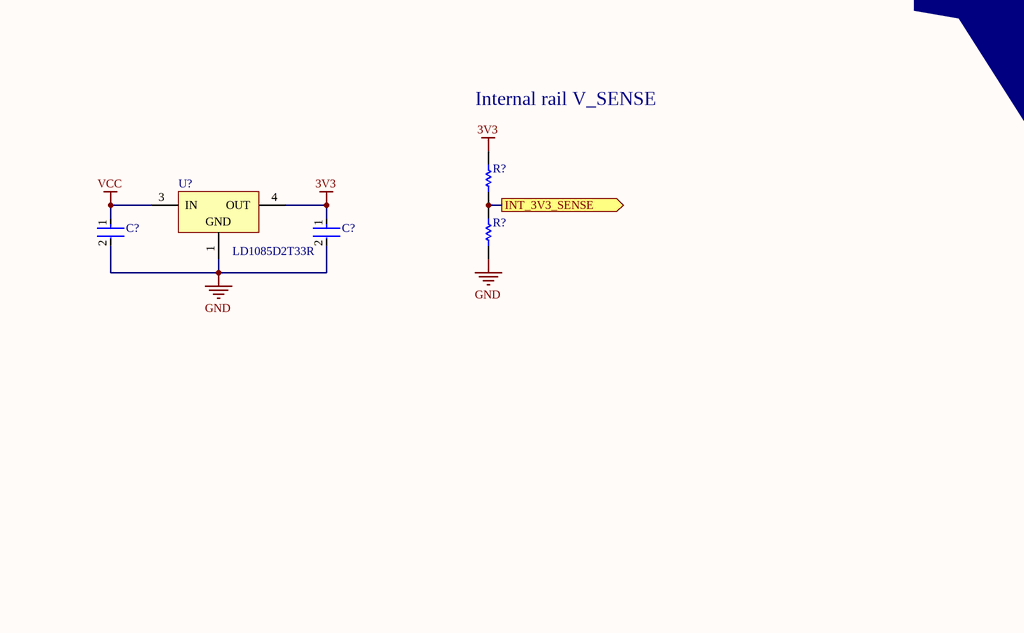
[diagram p3: INTERNAL_REGULATORS.SchDoc, top column 2 of 4]
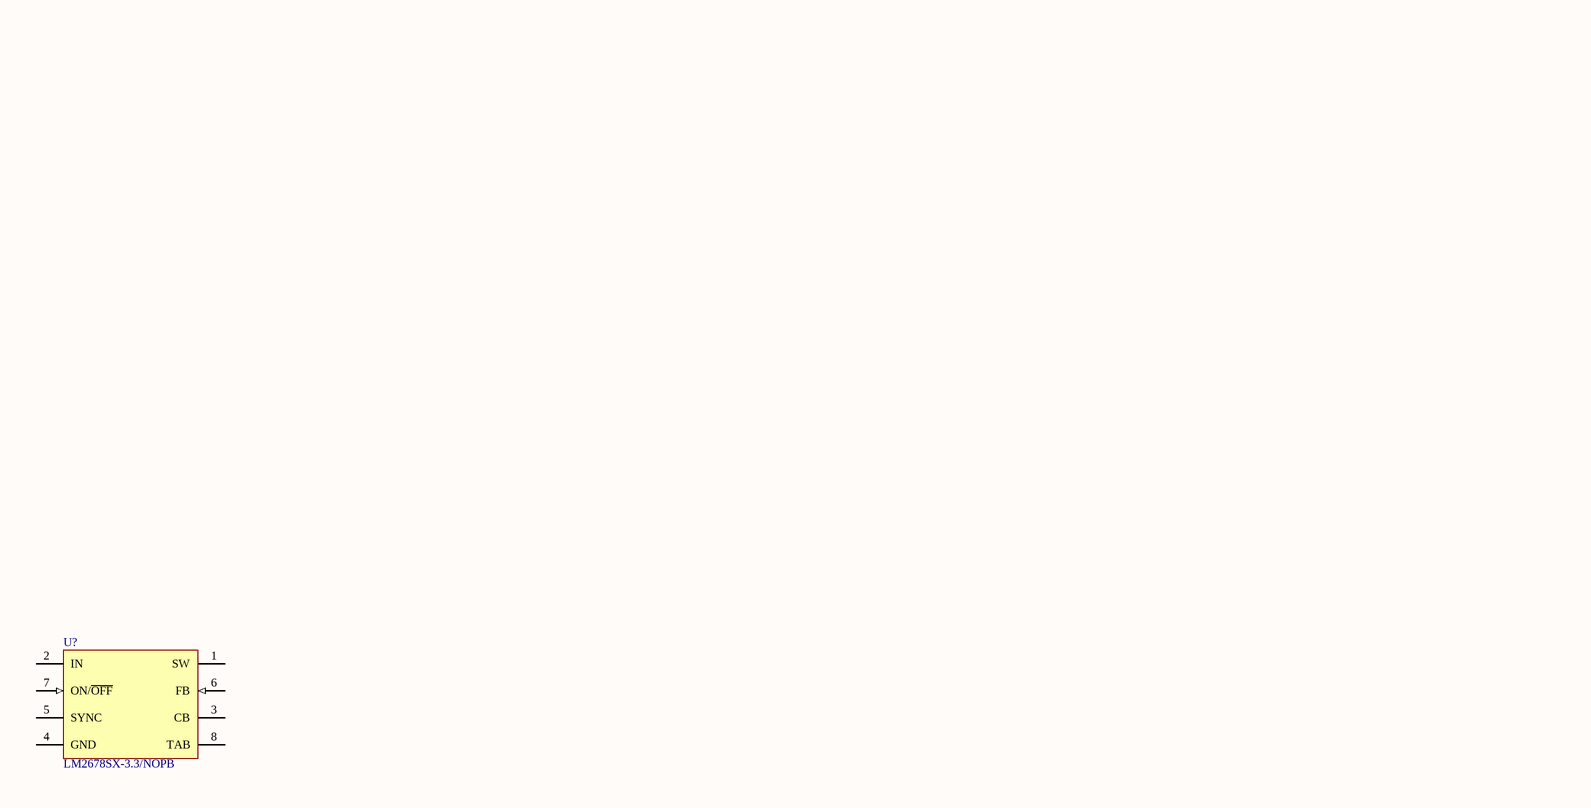
[diagram p4: INTERNAL_REGULATORS.SchDoc, bottom column 1 of 4]

### Parts
(Parts that share a designator on the sheet are numbered #1, #2 ... from top to bottom, then left to right.)
C?#1  C0805C106K8PACTU  [FP-C0805C-DG-MFG]  (value not drawn)
C?#2  C0805C106K8PACTU  [FP-C0805C-DG-MFG]  (value not drawn)
R?#1  ERJ3EKF1002V  [RESC1609X55X30LL15T15]  (value not drawn)
R?#2  ERJ3EKF1002V  [RESC1609X55X30LL15T15]  (value not drawn)
U?#1  LD1085D2T33R  [TO-263_N]
U?#2  LM2678SX-3.3/NOPB  [KTW0007B_M]

### Ports
INT_3V3_SENSE (out)

### Nets
3V3: C?#2.1 R?#1.2 U?#1.4(OUT)
GND: C?#1.2 C?#2.2 R?#2.1 U?#1.1(GND)
VCC: C?#1.1 U?#1.3(IN)
INT_3V3_SENSE: R?#1.1 R?#2.2 ; port INT_3V3_SENSE

Not connected (* = marked no-connect by the designer): U?#2 1(SW) 2(IN) 3(CB) 4(GND) 5(SYNC) 6(FB) 7(ON/~{OFF}) 8(TAB)

### Notes on the sheet
- Internal rail V_SENSE
- Yep
- That's all folks

### Library data of the parts
C?#1 C?#2 = CMP-2007-03243-2: CAP CER 10UF 10V X5R 0805; Manufacturer: Kemet; 3DS Part Number: 220-00001; Tolerance: 10%; Temperature Coefficient: 15%; Material: Ceramic; Device Class L2: Capacitors; Device Class L1: Passive Components; ComponentLink2URL: https://content.kemet.com/datasheets/KEM_C1006_X5R_SMD.pdf; Height: 1.4mm; Lead Free: Yes; Manufacturer Part Number: C0805C106K8PACTU; Digikey Description: CAP CER 10UF 10V X5R 0805; Octopart: https://octopart.com/c0805c106k8pactu-kemet-98697; Capacitance: 10uF; Value: 10uF; Temperature Range Low: -55°C; Temperature: -55°C to +85°C; Automotive: No; Mouser Description: CAP CER 10UF 10V X5R 0805; Ipc Land Pattern Name: CAPC200125X125; Temperature Range High: +85°C; Voltage: 10V; RoHS: TRUE; Device Class L3: Ceramic Capacitors; ComponentLink2Description: Datasheet; Voltage Rating: 10V; Package: C0805C-DG; Temperature Characteristic: X5R; Category: Cap
R?#1 R?#2 = CMP-1012-00623-3: as R1 on sheet PWR_MGMT; Number of Pins: 2; Package Reference: 603; Depth: 0.8mm; Mount: SurfaceMount; Package Description: 2-Pin Surface Mount Device, Body 1.6 x 0.85 mm; Datasheet Version: 02/2017; Length: 1.6mm; Lead Free: LeadFree; Height: 0.45mm; Number of Terminations: 2; Max Power Dissipation: 100mW; Min Operating Temperature: -55degC; Datasheet URL: https://industrial.panasonic.com/cdbs/www-data/pdf/RDA0000/AOA0000C304.pdf; Termination: SMD/SMT; Case Code (Metric): 1608; Case Code (Imperial): 0603; Tolerance: 1%; Max Operating Temperature: 155degC; RoHSCompliant: true; Voltage Rating (DC): 75V; Radiation Hardening: No; Packaging: TapeandReel; Composition: ThickFilm; Mounting Technology: SurfaceMount; Manufacturer URL: http://www.panasonic.com/; Width: 0.031inch; REACH SVHC: NoSVHC; Contact Plating: Tin; Military Standard: Not; Package Quantity: 1
U?#1 = CMP-0244-00169-1: 3A, Low Drop Positive Voltage Regulator, 3.3V, 3-Pin D2PAK; ComponentLink1URL: http://www.st.com; PackageVersion: 2011; ComponentLink1Description: Manufacturer URL; ComponentLink2URL: http://www.st.com/internet/com/TECHNICAL_RESOURCES/TECHNICAL_LITERATURE/DATASHEET/CD00001883.pdf; PackageDescription: 3-Pin Transistor Outline Package 2.54 mm Pitch, 15.4 mm Lead Span (D2PAK); DatasheetVersion: 28/07/2009; ComponentLink2Description: Datasheet; PackageReference: TO-263
U?#2 = CMP-0069-00200-3: VERY MUCH NOT A LM2677, USE A LM2678SX-3.3/NOPB; Manufacturer: Texas Instruments; PackageTopMarking: NSUZXYTTE#*LM2677S*-3.3; CompType: Switcher; PowerWise: N; Code_JEDEC: MO-169-AC; ComponentLink1URL: http://www.ti.com/general/docs/lit/getliterature.tsp?genericPartNumber=LM2677&fileType=pdf; PackageDescription: TO-263, Molded, .400 x .390 x .180in Body, 7 Lead, .050in Pitch, Surface Mount; PinCount: 7; ComponentLink1Description: Datasheet URL; RoHS: Y; PackageReference: KTW0007B